# EAGLE design 3filter (EAGLE 9.2.2)
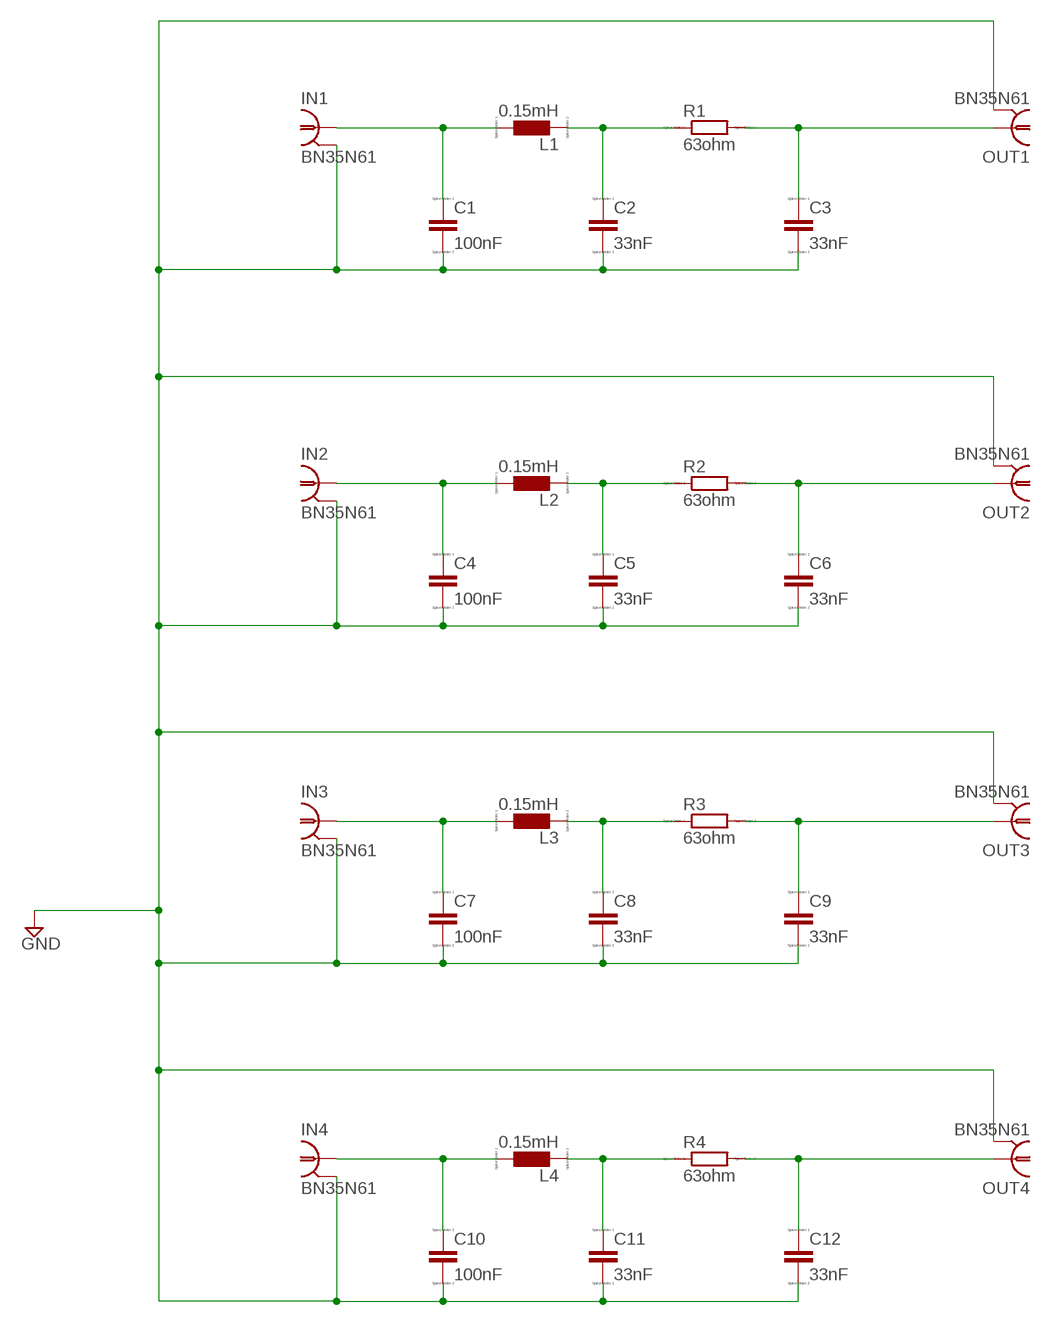
[diagram p0: schematic, sheet 1]

## Parts
C1  100nF  CC1210  [C1210]
C2  33nF  CC1210  [C1210]
C3  33nF  CC1210  [C1210]
C4  100nF  CC1210  [C1210]
C5  33nF  CC1210  [C1210]
C6  33nF  CC1210  [C1210]
C7  100nF  CC1210  [C1210]
C8  33nF  CC1210  [C1210]
C9  33nF  CC1210  [C1210]
C10  100nF  CC1210  [C1210]
C11  33nF  CC1210  [C1210]
C12  33nF  CC1210  [C1210]
IN1  BN35N61  [B35N61]
IN2  BN35N61  [B35N61]
IN3  BN35N61  [B35N61]
IN4  BN35N61  [B35N61]
L1  0.15mH  L  [L1812]
L2  0.15mH  L  [L1812]
L3  0.15mH  L  [L1812]
L4  0.15mH  L  [L1812]
OUT1  BN35N61  [B35N61]
OUT2  BN35N61  [B35N61]
OUT3  BN35N61  [B35N61]
OUT4  BN35N61  [B35N61]
R1  63ohm  R  [R0805]
R2  63ohm  R  [R0805]
R3  63ohm  R  [R0805]
R4  63ohm  R  [R0805]

## Nets
GND: C1.2 C2.2 C3.2 C4.2 C5.2 C6.2 C7.2 C8.2 C9.2 C10.2 C11.2 C12.2 IN1.2 IN1.3 IN1.4 IN1.5 IN2.2 IN2.3 IN2.4 IN2.5 IN3.2 IN3.3 IN3.4 IN3.5 IN4.2 IN4.3 IN4.4 IN4.5 OUT1.2 OUT1.3 OUT1.4 OUT1.5 OUT2.2 OUT2.3 OUT2.4 OUT2.5 OUT3.2 OUT3.3 OUT3.4 OUT3.5 OUT4.2 OUT4.3 OUT4.4 OUT4.5
N$1: C1.1 IN1.1 L1.1
N$2: C2.1 L1.2 R1.1
N$3: C3.1 OUT1.1 R1.2
N$4: C4.1 IN2.1 L2.1
N$5: C5.1 L2.2 R2.1
N$6: C6.1 OUT2.1 R2.2
N$7: C7.1 IN3.1 L3.1
N$8: C8.1 L3.2 R3.1
N$9: C9.1 OUT3.1 R3.2
N$10: C10.1 IN4.1 L4.1
N$11: C11.1 L4.2 R4.1
N$12: C12.1 OUT4.1 R4.2

## Library data of the parts
C1-C12 = eagle-ltspice:C: CAPACITOR, European symbol; SPICEMODEL: NONE; SPICEPREFIX: C
IN1-IN4 OUT1-OUT4 = con-coax:BN35N61: BNC CONNECTOR M/A COM www.macom.com distributor Farnell 149-452; OC_FARNELL: unknown; OC_NEWARK: unknown
L1-L4 = eagle-ltspice:L: INDUCTOR, European symbol; SPICEMODEL: NONE; SPICEPREFIX: L
R1-R4 = eagle-ltspice:R: RESISTOR, European symbol; SPICEMODEL: NONE; SPICEPREFIX: R

## Board
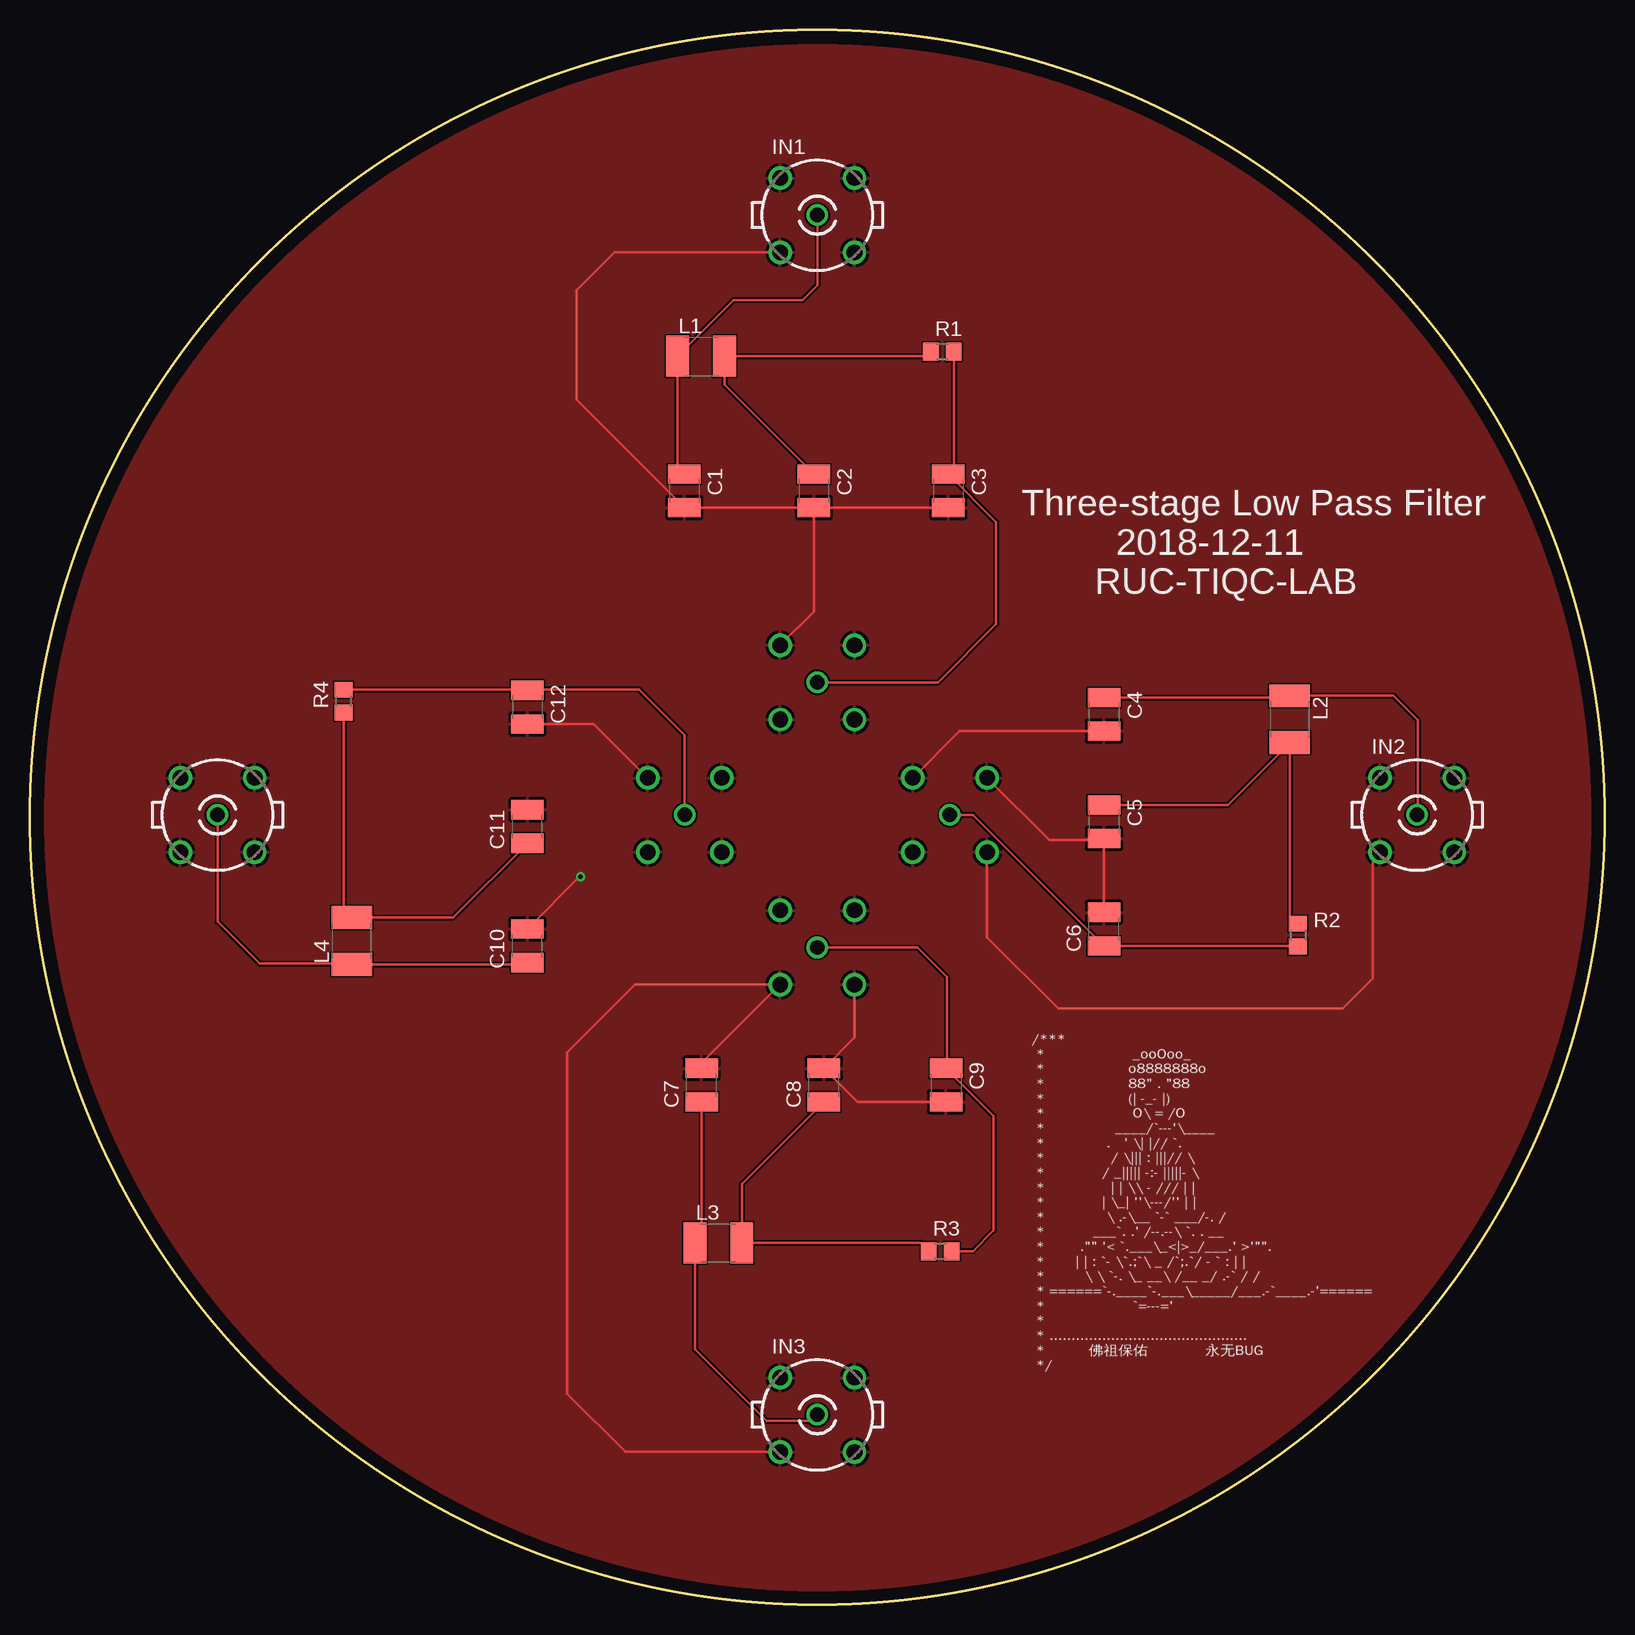
[diagram p1: board, top side]
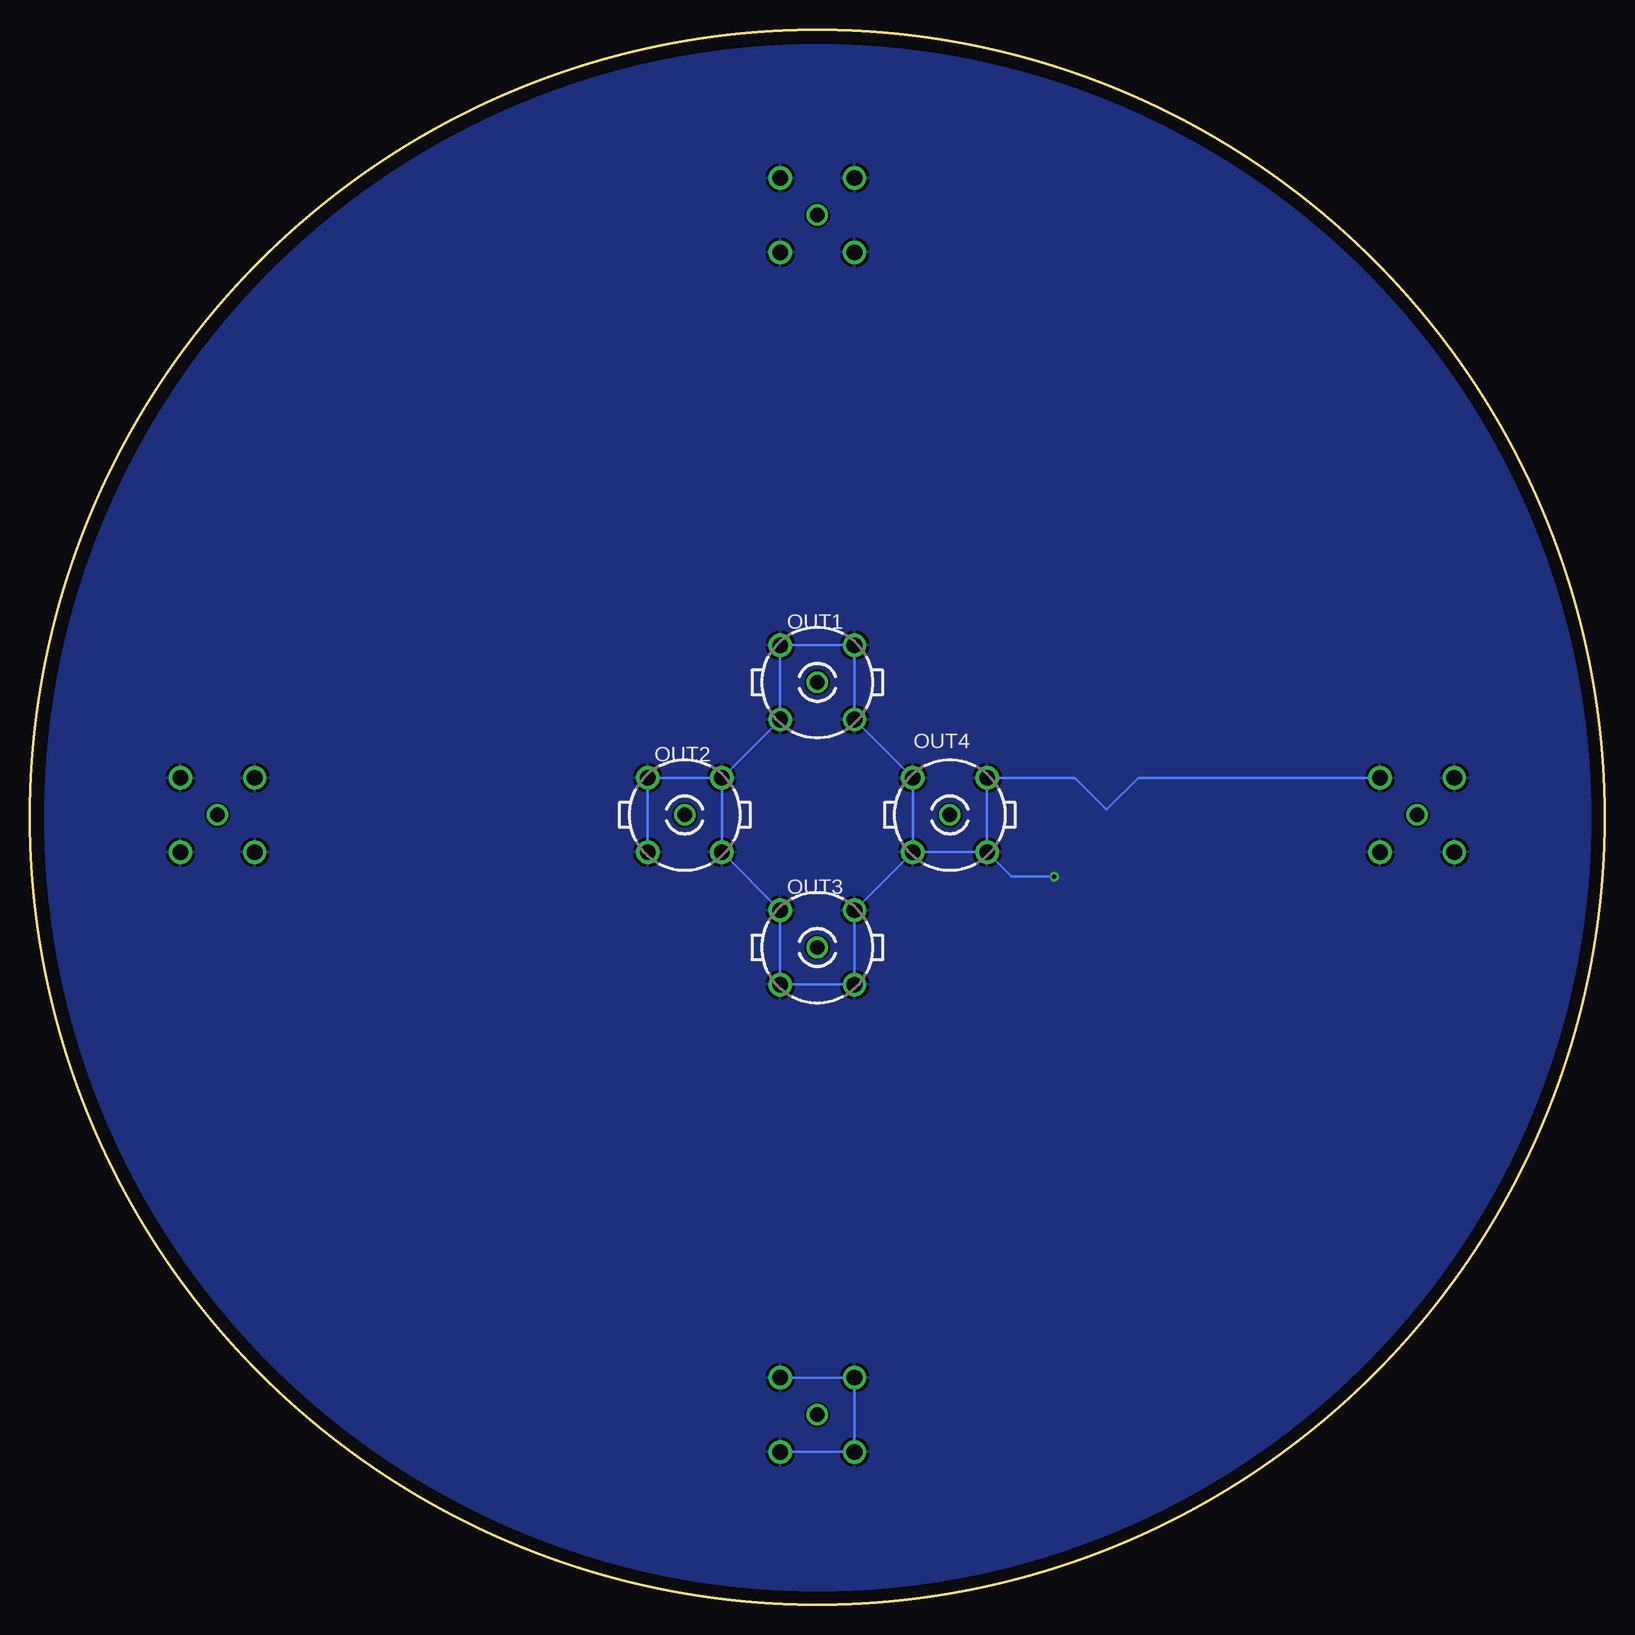
[diagram p2: board, bottom side, seen from below]

Size 131.26 x 131.26 mm. Coordinates in mm from the lower left corner, seen from the top.
Outline: circle at 65.63,65.63 radius 65.63
Copper layers (1*16): Top 0.035mm / dielectric 1.5mm / Bottom 0.035mm
Design rules "default": minimum track width 6mil, minimum drill 0.35mm, track to track 6mil, track to pad 6mil, pad to pad 6mil, via to via 6mil, smd to smd 6mil, copper to edge 40mil, drill to drill 6mil, minimum pad ring 10mil, minimum via ring 8mil, stop-mask expansion 4mil, vias tented up to drill 0mil, thermal gap 10mil

### Footprints (pad centres in the part's own frame; a part is rotated, then mirrored left to right if it is on the bottom)
C1210 = smd 1.6 x 2.7: 1 -1.4,0; 2 1.4,0
B35N61 = drill 1.2: 1 0,0 | drill 1.3: 2 3.099,3.099; 3 -3.099,3.099; 4 -3.099,-3.099; 5 3.099,-3.099
L1812 = smd 1.9 x 3.4: 1 -1.95,0; 2 1.95,0
R0805 = smd 1.3 x 1.5: 1 -0.95,0; 2 0.95,0

### Placement (x,y rotation side)
C1  54.54,92.85 270 top
C2  65.34,92.85 270 top
C3  76.54,92.85 270 top
C4  89.53,74.22 270 top
C5  89.53,65.27 270 top
C6  89.53,56.32 90 top
C7  55.99,43.32 90 top
C8  66.18,43.32 90 top
C9  76.36,43.32 270 top
C10  41.46,54.92 90 top
C11  41.46,64.87 90 top
C12  41.46,74.82 270 top
IN1  65.63,115.83 0 top
IN2  115.63,65.83 0 top
IN3  65.63,15.83 0 top
IN4  15.63,65.83 0 top
L1  55.93,104.07 0 top
L2  105,73.82 270 top
L3  57.38,30.16 0 top
L4  26.83,55.32 90 top
OUT1  65.63,76.88 0 bottom
OUT2  76.68,65.83 0 bottom
OUT3  65.63,54.78 0 bottom
OUT4  54.58,65.83 0 bottom
R1  76.05,104.47 0 top
R2  105.69,55.82 270 top
R3  75.87,29.47 0 top
R4  26.14,75.32 90 top

### Tracks (layer width: path | path; a pad name or v marks a point on that pad's centre or on a via)
GND  (via drill 0.35)
  Top 0.2: C10.2 45.82,60.68 v45.88,60.68 | C12.2 46.99,73.42 OUT4.2 | C1.2 54.58,91.45 | 54.58,91.45 C2.2 | C3.2 C2.2 | C2.2 65.34,82.79 OUT1.2 | IN1.4 48.73,112.73 45.58,109.58 45.58,100.45 54.58,91.45 | OUT2.4 79.78,55.63 85.73,49.68 109.43,49.68 111.93,52.18 111.93,62.13 IN2.4 | C4.2 77.47,72.82 OUT2.2 | C5.2 89.53,63.73 | 89.53,63.73 C6.2 | 79.78,69.08 OUT2.3 84.98,63.73 89.53,63.73 | OUT3.4 68.73,47.28 C8.2 68.98,41.92 C9.2 | C7.2 55.99,45.14 OUT3.5 50.43,51.68 44.78,46.03 44.78,17.58 49.63,12.73 IN3.4
  Bottom 0.2: IN4.2 38.88,68.93 41.53,66.28 44.18,68.93 OUT4.2 OUT4.5 | v45.88,60.68 49.43,60.68 OUT4.5 | OUT1.2 62.93,79.98 | 62.93,79.98 OUT1.3 OUT1.4 68.73,73.73 73.81,68.66 | 62.93,79.98 62.53,79.58 OUT1.5 OUT4.3 OUT4.4 | OUT4.5 OUT4.4 | 73.81,68.66 73.93,68.53 | OUT2.2 OUT2.5 OUT3.3 OUT3.4 62.58,51.68 62.53,51.73 | 73.81,68.66 74.08,68.93 OUT2.3 OUT2.4 | 62.53,51.73 OUT3.2 OUT4.4 | 62.53,51.73 OUT3.5 | IN3.5 IN3.4 IN3.3 IN3.2
  pour Top: 0.03,65.68 0.03,65.73 arc-90 65.83,131.53 65.93,131.53 arc-90 132.03,65.43 arc-90 66.18,-0.42 66.08,-0.42 66.03,-0.42 arc-90 0.03,65.58
  pour Bottom: -0.27,65.83 -0.27,65.98 arc-90 65.33,131.58 65.88,131.58 arc-90 131.63,65.83 131.63,65.03 131.63,64.73 arc-90 66.28,-0.62 66.13,-0.62 arc-90 -0.27,65.78
N$1
  Top 0.2: C1.1 53.98,94.81 53.98,103.93 | 53.98,103.93 L1.1 58.64,108.73 64.38,108.73 65.63,109.98 IN1.1 | 54.03,103.98 53.98,103.93
N$2
  Top 0.2: R1.1 74.7,104.07 L1.2 57.88,101.71 C2.1
N$3
  Top 0.2: R1.2 77,94.71 C3.1 80.53,90.26 80.53,81.73 75.68,76.88 OUT1.1
N$4
  Top 0.2: L2.1 105.23,75.77 | 105.23,75.77 113.64,75.77 115.68,73.73 115.68,65.88 IN2.1 | C4.1 105.08,75.62 105.23,75.77
N$5
  Top 0.2: L2.2 105,71.83 | 105,71.83 105,57.46 R2.1 | C5.1 99.84,66.67 105,71.83
N$6
  Top 0.2: R2.2 105.64,54.92 C6.1 78.62,65.83 OUT2.1
N$7
  Top 0.2: C7.1 55.99,30.72 L3.1 55.43,21.28 61.38,15.33 65.13,15.33 IN3.1
N$8
  Top 0.2: R3.1 74.23,30.16 L3.2 59.33,35.08 C8.1
N$9
  Top 0.2: OUT3.1 73.98,54.78 76.43,52.33 76.43,44.79 C9.1 80.33,40.75 80.33,31.18 78.62,29.47 R3.2
N$10
  Top 0.2: C10.1 41.31,53.37 L4.1 26.77,53.43 19.13,53.43 15.63,56.93 IN4.1
N$11
  Top 0.2: R4.1 26.14,57.97 L4.2 35.26,57.27 C11.1
N$12
  Top 0.2: OUT4.1 54.58,72.48 50.78,76.28 41.52,76.28 41.51,76.27 | 41.51,76.27 C12.1 | R4.2 41.51,76.27

### Text on the board
tPlace: Three-stage Low Pass Filter / 2018-12-11 / RUC-TIQC-LAB | /*** / * _ooOoo_ / * o8888888o / * 88" . "88 / * (| -_- |) / * O\ = /O / * ____/`---'\____ / * . ' \\| |// `. / * / \\||| : |||// \ / * / _||||| -:- |||||- \ / * | | \\\ - /// | | / * | \_| ''\---/'' | | / * \ .-\__ `-` ___/-. / / * ___`. .' /--.--\ `. . __ / * ."" '< `.___\_<|>_/___.' >'"". / * | | : `- \`.;`\ _ /`;.`/ - ` : | | / * \ \ `-. \_ __\ /__ _/ .-` / / / * ======`-.____`-.___\_____/___.-`____.-'====== / * `=---=' / * / * ............................................. / * 佛祖保佑 永无BUG / */